# Altium schematic sheet adafruit_feather.SchDoc: MOSFET DRIVER
size B; Revision: 1.0; SheetNumber: 1; SheetTotal: x; DocumentName: INPUTS
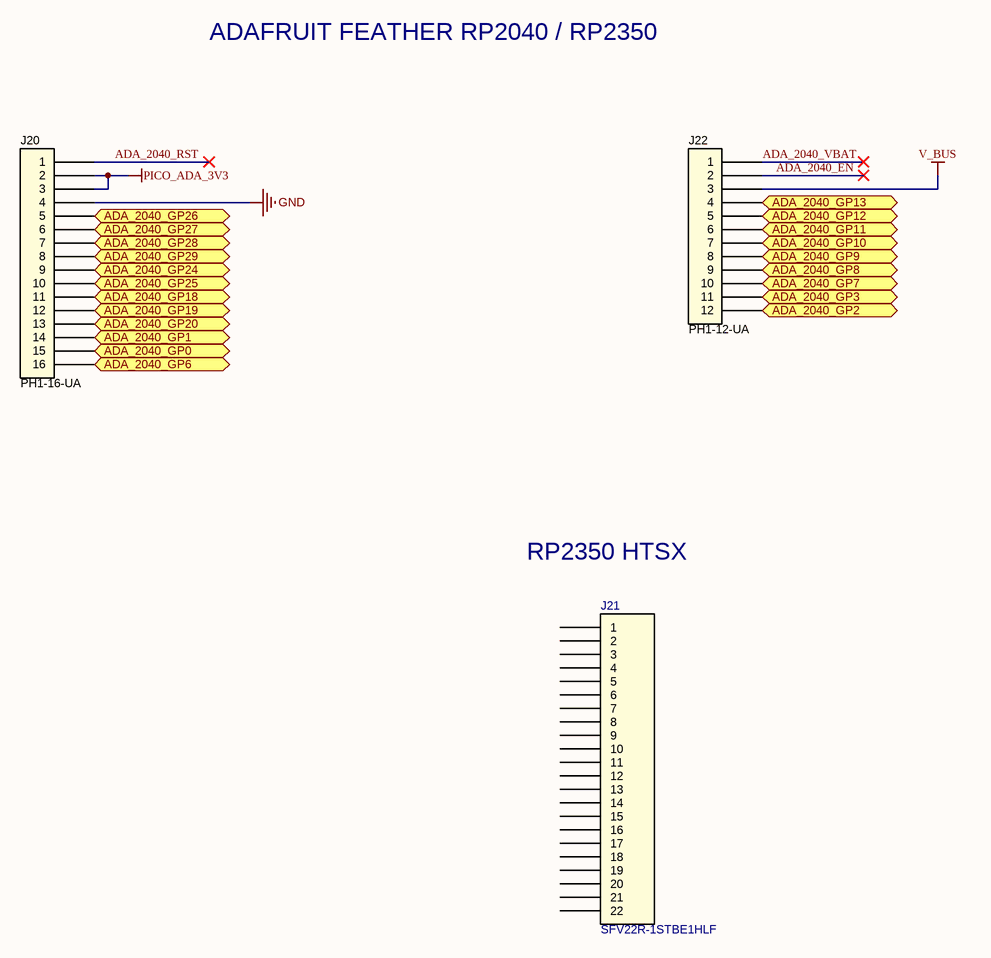
[diagram p0: adafruit_feather.SchDoc]

## Parts
J20  PH1-16-UA  [CONN_ADAM_TECH_PH1-16-UA]
J21  SFV22R-1STBE1HLF  [CONN_AMPHENOL_SFV22R-1STBE1HLF]
J22  PH1-12-UA  [CONN_ADAM_TECH_PH1-12-UA]

## Ports
ADA_2040_GP0 (bidir), ADA_2040_GP1 (bidir), ADA_2040_GP2 (bidir), ADA_2040_GP3 (bidir), ADA_2040_GP6 (bidir), ADA_2040_GP7 (bidir), ADA_2040_GP8 (bidir), ADA_2040_GP9 (bidir), ADA_2040_GP10 (bidir), ADA_2040_GP11 (bidir), ADA_2040_GP12 (bidir), ADA_2040_GP13 (bidir), ADA_2040_GP18 (bidir), ADA_2040_GP19 (bidir), ADA_2040_GP20 (bidir), ADA_2040_GP24 (bidir), ADA_2040_GP25 (bidir), ADA_2040_GP26 (bidir), ADA_2040_GP27 (bidir), ADA_2040_GP28 (bidir), ADA_2040_GP29 (bidir)

## Nets
GND: J20.4
PICO_ADA_3V3: J20.2 J20.3
V_BUS: J22.3
ADA_2040_EN: J22.2
ADA_2040_GP0: J20.15 ; port ADA_2040_GP0
ADA_2040_GP1: J20.14 ; port ADA_2040_GP1
ADA_2040_GP2: J22.12 ; port ADA_2040_GP2
ADA_2040_GP3: J22.11 ; port ADA_2040_GP3
ADA_2040_GP6: J20.16 ; port ADA_2040_GP6
ADA_2040_GP7: J22.10 ; port ADA_2040_GP7
ADA_2040_GP8: J22.9 ; port ADA_2040_GP8
ADA_2040_GP9: J22.8 ; port ADA_2040_GP9
ADA_2040_GP10: J22.7 ; port ADA_2040_GP10
ADA_2040_GP11: J22.6 ; port ADA_2040_GP11
ADA_2040_GP12: J22.5 ; port ADA_2040_GP12
ADA_2040_GP13: J22.4 ; port ADA_2040_GP13
ADA_2040_GP18: J20.11 ; port ADA_2040_GP18
ADA_2040_GP19: J20.12 ; port ADA_2040_GP19
ADA_2040_GP20: J20.13 ; port ADA_2040_GP20
ADA_2040_GP24: J20.9 ; port ADA_2040_GP24
ADA_2040_GP25: J20.10 ; port ADA_2040_GP25
ADA_2040_GP26: J20.5 ; port ADA_2040_GP26
ADA_2040_GP27: J20.6 ; port ADA_2040_GP27
ADA_2040_GP28: J20.7 ; port ADA_2040_GP28
ADA_2040_GP29: J20.8 ; port ADA_2040_GP29
ADA_2040_RST: J20.1
ADA_2040_VBAT: J22.1

Not connected (* = marked no-connect by the designer): J21 1 2 3 4 5 6 7 8 9 10 11 12 13 14 15 16 17 18 19 20 21 22

## Notes on the sheet
- ADAFRUIT FEATHER RP2040 / RP2350
- RP2350 HTSX
- Title
- Size:
- Date:
- B
- Number:
- Time:
- Revision:
- Sheet
- of
- File:

## Library data of the parts
J20 = CMP-007-0080: CONN HEADER VERT 16POS 2.54MM GOLD; MFR: Adam Tech; Voltage Rating: 250V AC(RMS)/DC; Durability: 50 mating cycles; Current Rating: 1A; System: Connector; Temp Range: -40 / +105 C; Gender: Male; Value: PH1-16-UA; Orientation: Verticle; Terminal Pitch: 2.54mm; RoHS Compliant: Yes; Design Item ID: CON/16P/2.54mm/2A/PH1-16-UA/Adam Tech; MFR#: PH1-16-UA; Contact Finish: Gold; ComponentLink1Description: Drawing; ComponentLink1URL: https://app.adam-tech.com/products/download/data_sheet/201605/ph1-xx-ua-data-sheet.pdf
J21 = CMP-007-0081: CONN FFC BOTTOM 22POS 0.5MM R/A; MFR: Amphenol ICC (FCI); Value: SFV22R-1STBE1HLF; MFR#: SFV22R-1STBE1HLF; ComponentLink1URL: https://cdn.amphenol-cs.com/media/wysiwyg/files/documentation/datasheet/flex/flexconnectors_050mm_sfvr.pdf; ComponentLink1Description: Datasheet; Contact Finish: Tin; Type: Connector; Design Item ID: CON/22P/0.5MM/0.5A/SFV22R-1STBE1HLF/AMPHENOL
J22 = CMP-007-0079: CONN HEADER VERT 12POS 2.54MM GOLD; MFR: Adam Tech; Voltage Rating: 250V AC(RMS)/DC; Durability: 50 mating cycles; Current Rating: 1A; System: Connector; Temp Range: -40 / +105 C; Gender: Male; Value: PH1-12-UA; Orientation: Verticle; Terminal Pitch: 2.54mm; RoHS Compliant: Yes; Design Item ID: CON/12P/2.54mm/2A/PH1-12-UA/Adam Tech; MFR#: PH1-12-UA; Contact Finish: Gold; ComponentLink1Description: Drawing; ComponentLink1URL: https://app.adam-tech.com/products/download/data_sheet/201605/ph1-xx-ua-data-sheet.pdf